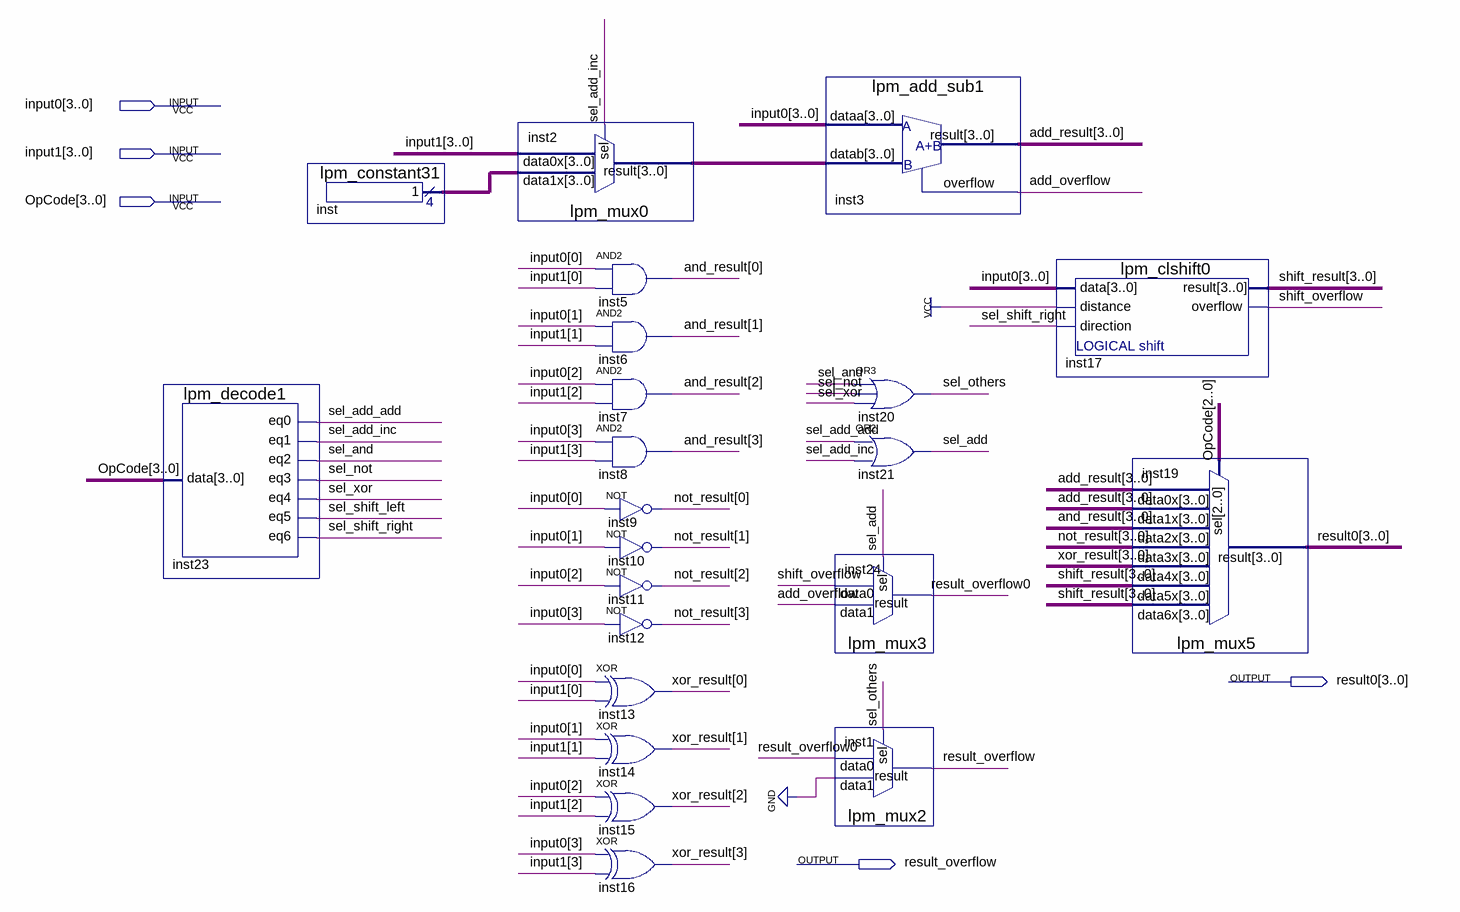
[diagram p0: schematic sheet]
// Quartus schematic Group4_selimtarik_pinar_2023510175_ALU.bdf as structural Verilog: 22 symbols, 5 pins
module Group4_selimtarik_pinar_2023510175_ALU (
  input  [3:0] input0,
  input  [3:0] input1,
  input  [3:0] OpCode,
  output [3:0] result0,
  output result_overflow
);

  wire add_overflow, result_overflow0, sel_add, sel_add_add, sel_add_inc, sel_and, sel_not, sel_others,
       sel_shift_left, sel_shift_right, sel_xor, shift_overflow;
  wire [3:0] add_result, and_result, inst2_result, inst_result, not_result, shift_result, xor_result;

  lpm_decode1 inst23 (
    .data(OpCode), .eq0(sel_add_add), .eq1(sel_add_inc), .eq2(sel_and), .eq3(sel_not), .eq4(sel_xor),
    .eq5(sel_shift_left), .eq6(sel_shift_right));
  lpm_constant31 inst (.result(inst_result));
  lpm_mux0 inst2 (.data1x(inst_result), .data0x(input1), .sel(sel_add_inc), .result(inst2_result));
  and inst5 (and_result[0], input0[0], input1[0]);
  and inst6 (and_result[1], input0[1], input1[1]);
  and inst7 (and_result[2], input0[2], input1[2]);
  and inst8 (and_result[3], input0[3], input1[3]);
  xor inst13 (xor_result[0], input0[0], input1[0]);
  xor inst14 (xor_result[1], input0[1], input1[1]);
  xor inst15 (xor_result[2], input0[2], input1[2]);
  xor inst16 (xor_result[3], input0[3], input1[3]);
  not inst9 (not_result[0], input0[0]);
  not inst10 (not_result[1], input0[1]);
  not inst11 (not_result[2], input0[2]);
  not inst12 (not_result[3], input0[3]);
  lpm_add_sub1 inst3 (.dataa(input0), .datab(inst2_result), .result(add_result), .overflow(add_overflow));
  or inst20 (sel_others, sel_and, sel_not, sel_xor);
  or inst21 (sel_add, sel_add_add, sel_add_inc);
  lpm_mux3 inst24 (.data1(add_overflow), .data0(shift_overflow), .sel(sel_add), .result(result_overflow0));
  lpm_mux2 inst1 (.data1(1'b0), .data0(result_overflow0), .sel(sel_others), .result(result_overflow));
  lpm_clshift0 inst17 (
    .data(input0), .distance(1'b1), .direction(sel_shift_right), .result(shift_result),
    .overflow(shift_overflow));
  lpm_mux5 inst19 (
    .data6x(shift_result), .data5x(shift_result), .data4x(xor_result), .data3x(not_result),
    .data2x(and_result), .data1x(add_result), .data0x(add_result), .sel(OpCode[2:0]), .result(result0));
endmodule
